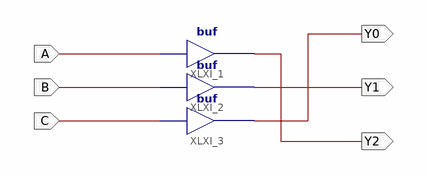
[diagram p0: schematic sheet 1]
// Xilinx ISE schematic reverse.sch (zynq) as structural Verilog: 3 symbols, 6 ports
module reverse (
  input  A,
  input  B,
  input  C,
  output Y2,
  output Y1,
  output Y0
);

  buf XLXI_1 (Y2, A);
  buf XLXI_2 (Y1, B);
  buf XLXI_3 (Y0, C);
endmodule
